# EAGLE schematic Cont (EAGLE 7.2.0)
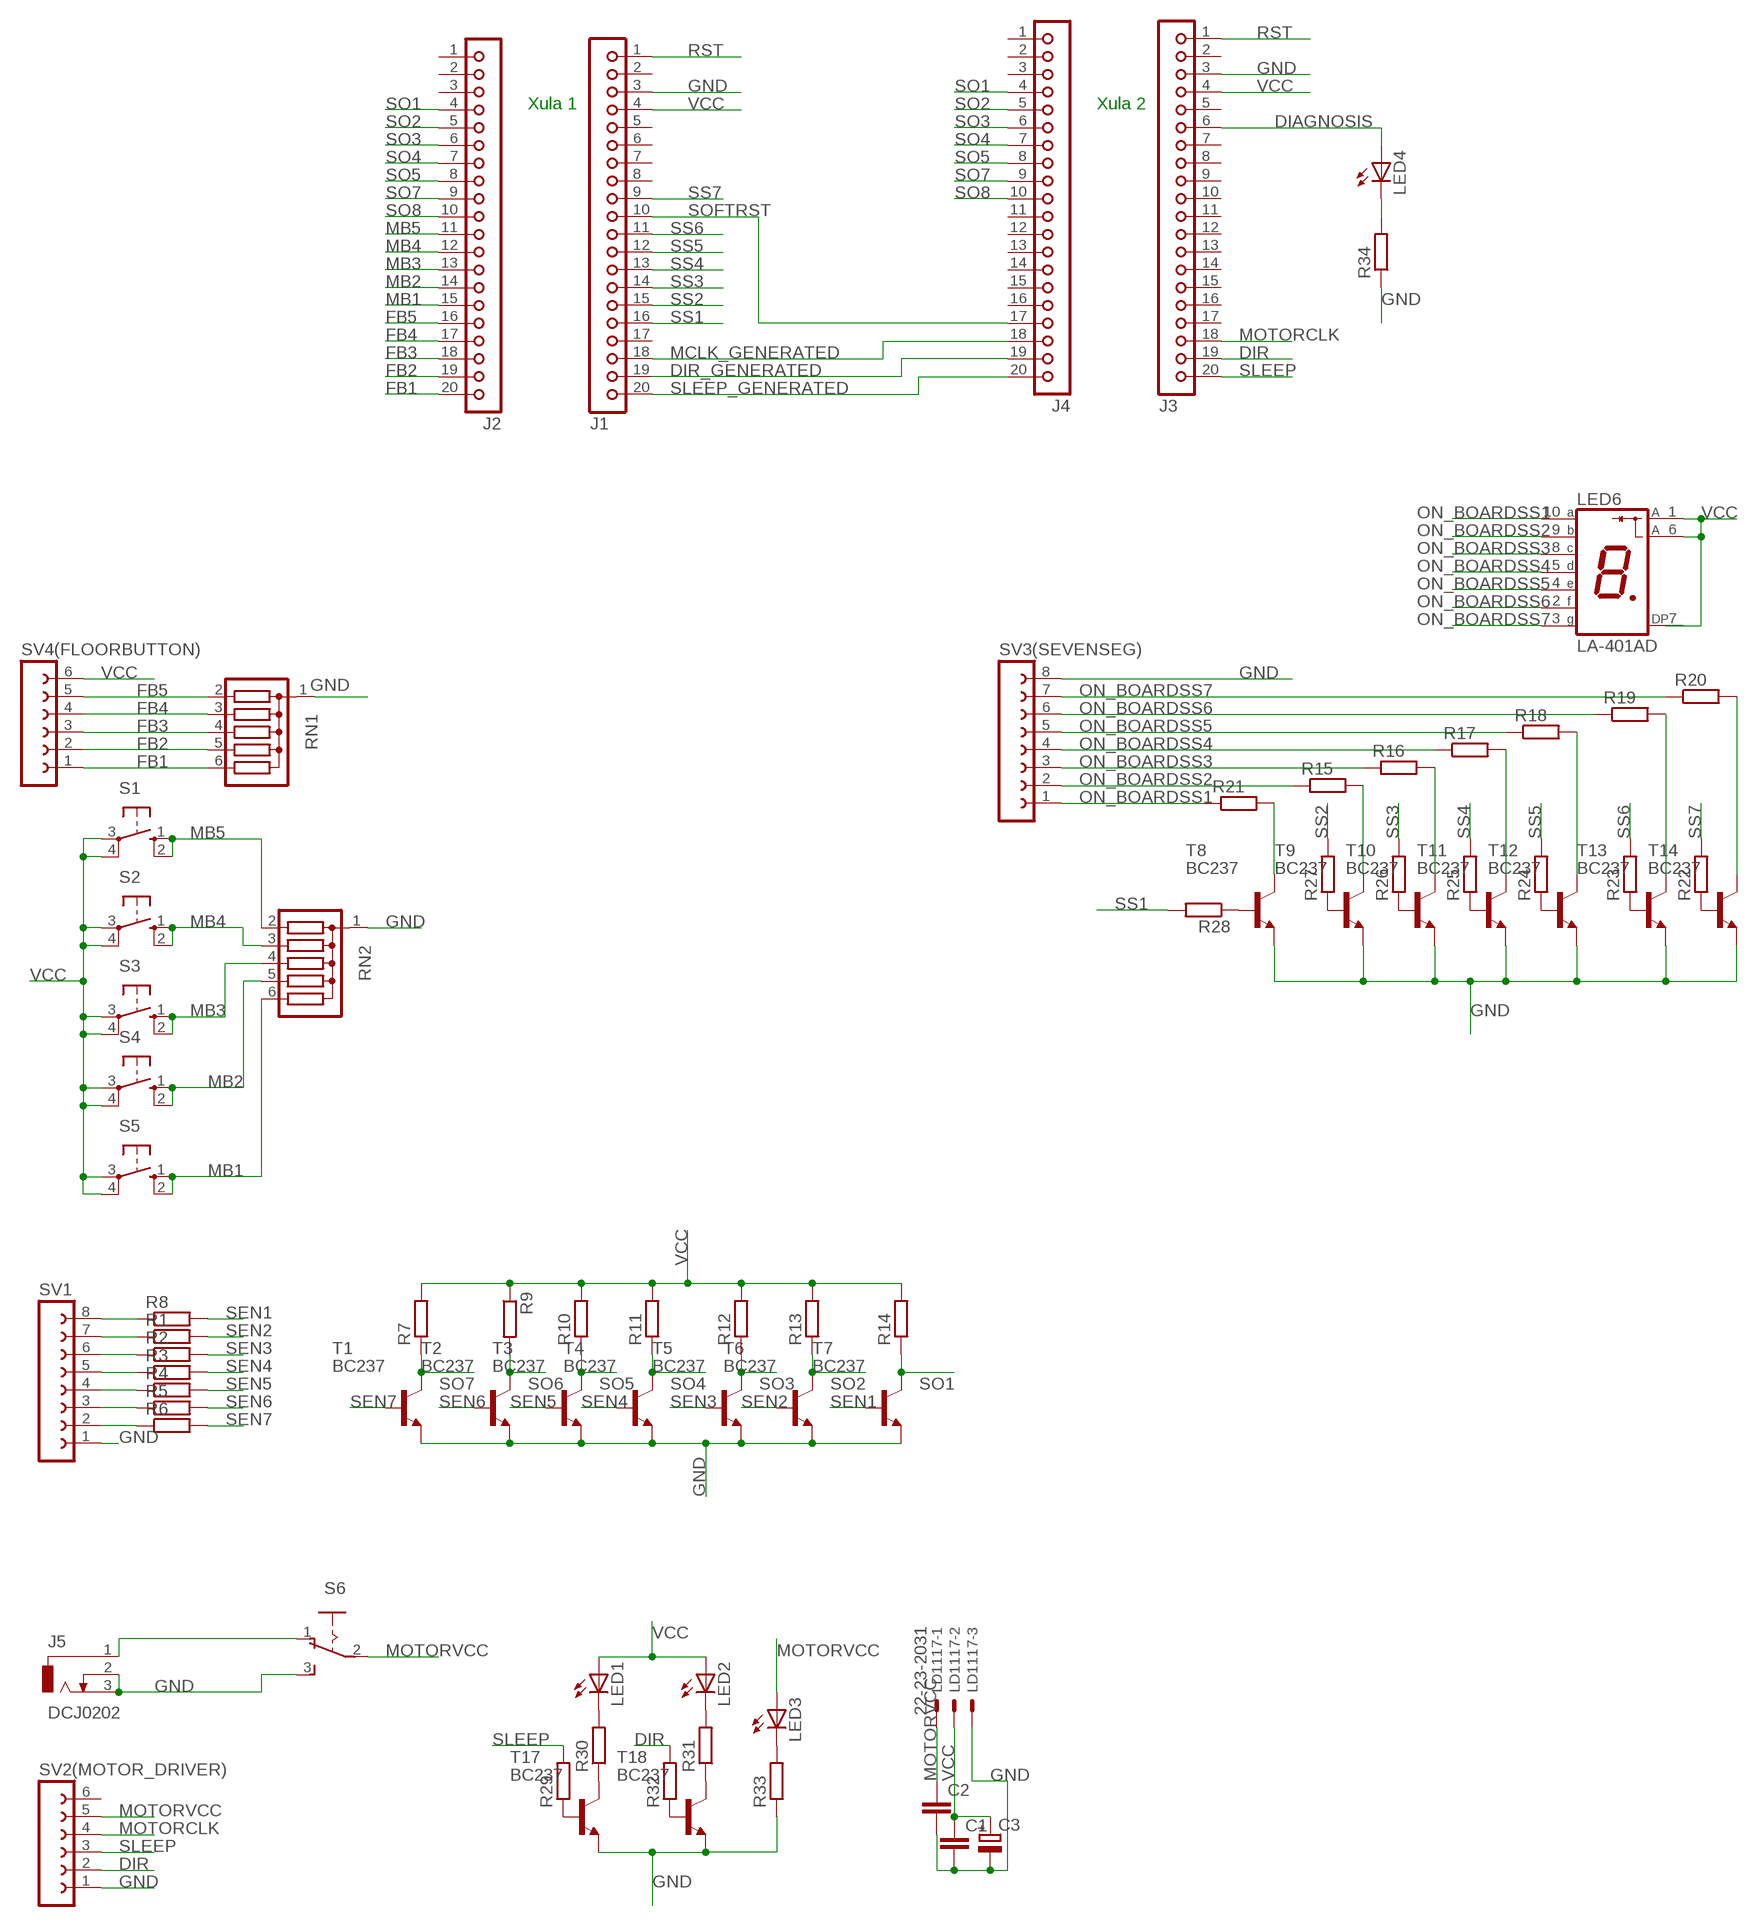
[diagram p0: schematic, sheet 1]

## Parts
C1  C-EU025-025X050  [C025-025X050]
C2  C-EU025-025X050  [C025-025X050]
C3  CPOL-EUE3.5-8  [E3,5-8]
J1  JBK20  [JBK20]
J2  JBK20  [JBK20]
J3  JBK20  [JBK20]
J4  JBK20  [JBK20]
J5  DCJ0202  [DCJ0202]
LD1117  22-23-2031  [22-23-2031]
LED1  LED3MM  [LED3MM]
LED2  LED3MM  [LED3MM]
LED3  LED3MM  [LED3MM]
LED4  LED3MM  [LED3MM]
LED6  LA-401AD  [LA-401]
R1  R-EU_0204/5  [0204/5]
R2  R-EU_0204/5  [0204/5]
R3  R-EU_0204/5  [0204/5]
R4  R-EU_0204/5  [0204/5]
R5  R-EU_0204/5  [0204/5]
R6  R-EU_0204/5  [0204/5]
R7  R-EU_0204/5  [0204/5]
R8  R-EU_0204/5  [0204/5]
R9  R-EU_0204/5  [0204/5]
R10  R-EU_0204/5  [0204/5]
R11  R-EU_0204/5  [0204/5]
R12  R-EU_0204/5  [0204/5]
R13  R-EU_0204/5  [0204/5]
R14  R-EU_0204/5  [0204/5]
R15  R-EU_0204/5  [0204/5]
R16  R-EU_0204/5  [0204/5]
R17  R-EU_0204/5  [0204/5]
R18  R-EU_0204/5  [0204/5]
R19  R-EU_0204/5  [0204/5]
R20  R-EU_0204/5  [0204/5]
R21  R-EU_0204/5  [0204/5]
R22  R-EU_0204/5  [0204/5]
R23  R-EU_0204/5  [0204/5]
R24  R-EU_0204/5  [0204/5]
R25  R-EU_0204/5  [0204/5]
R26  R-EU_0204/5  [0204/5]
R27  R-EU_0204/5  [0204/5]
R28  R-EU_0204/5  [0204/5]
R29  R-EU_0204/5  [0204/5]
R30  R-EU_0204/5  [0204/5]
R31  R-EU_0204/5  [0204/5]
R32  R-EU_0204/5  [0204/5]
R33  R-EU_0204/5  [0204/5]
R34  R-EU_0204/5  [0204/5]
RN1  G05R  [SIL6]
RN2  G05R  [SIL6]
S1  10-XX  [B3F-10XX]
S2  10-XX  [B3F-10XX]
S3  10-XX  [B3F-10XX]
S4  10-XX  [B3F-10XX]
S5  10-XX  [B3F-10XX]
S6  255SB  [255SB]
SV1  FE08-1  [FE08]
SV2(MOTOR_DRIVER)  FE06-1  [FE06]
SV3(SEVENSEG)  FE08W  [FE08W]
SV4(FLOORBUTTON)  FE06-1  [FE06]
T1  BC237  [TO92]
T2  BC237  [TO92]
T3  BC237  [TO92]
T4  BC237  [TO92]
T5  BC237  [TO92]
T6  BC237  [TO92]
T7  BC237  [TO92]
T8  BC237  [TO92]
T9  BC237  [TO92]
T10  BC237  [TO92]
T11  BC237  [TO92]
T12  BC237  [TO92]
T13  BC237  [TO92]
T14  BC237  [TO92]
T17  BC237  [TO92]
T18  BC237  [TO92]

## Nets
DIAGNOSIS: J3.6 LED4.A
DIR: J3.19 R32.2 SV2(MOTOR_DRIVER).2
DIR_GENERATED: J1.19 J4.19
FB1: J2.20 RN1.6 SV4(FLOORBUTTON).1
FB2: J2.19 RN1.5 SV4(FLOORBUTTON).2
FB3: J2.18 RN1.4 SV4(FLOORBUTTON).3
FB4: J2.17 RN1.3 SV4(FLOORBUTTON).4
FB5: J2.16 RN1.2 SV4(FLOORBUTTON).5
GND: C1.2 C2.2 C3.- J1.3 J3.3 J5.2 J5.3 LD1117.3 R6.1 R33.1 R34.1 RN1.1 RN2.1 S6.3(S) SV1.1 SV1.2 SV2(MOTOR_DRIVER).1 SV3(SEVENSEG).8 T1.1(E) T2.1(E) T3.1(E) T4.1(E) T5.1(E) T6.1(E) T7.1(E) T8.1(E) T9.1(E) T10.1(E) T11.1(E) T12.1(E) T13.1(E) T14.1(E) T17.1(E) T18.1(E)
MB1: J2.15 RN2.6 S5.1(S) S5.2(S1)
MB2: J2.14 RN2.5 S4.1(S) S4.2(S1)
MB3: J2.13 RN2.4 S3.1(S) S3.2(S1)
MB4: J2.12 RN2.3 S2.1(S) S2.2(S1)
MB5: J2.11 RN2.2 S1.1(S) S1.2(S1)
MCLK_GENERATED: J1.18 J4.18
MOTORCLK: J3.18 SV2(MOTOR_DRIVER).4
MOTORVCC: C2.1 LD1117.1 LED3.A S6.2(P) SV2(MOTOR_DRIVER).5
N$1: R2.1 SV1.6
N$2: R21.2 T8.3(C)
N$3: LED4.K(C) R34.2
N$4: R15.2 T9.3(C)
N$5: R16.2 T10.3(C)
N$6: R17.2 T11.3(C)
N$7: R18.2 T12.3(C)
N$8: R19.2 T13.3(C)
N$9: R5.1 SV1.3
N$10: R4.1 SV1.4
N$11: R3.1 SV1.5
N$12: R1.1 SV1.7
N$13: R8.1 SV1.8
N$14: R20.2 T14.3(C)
N$15: J5.1 S6.1(O)
N$28: R22.1 T14.2(B)
N$29: R23.1 T13.2(B)
N$30: R24.1 T12.2(B)
N$31: R25.1 T11.2(B)
N$32: R26.1 T10.2(B)
N$33: R27.1 T9.2(B)
N$34: R28.1 T8.2(B)
N$35: R29.1 T17.2(B)
N$36: R30.1 T17.3(C)
N$37: R31.1 T18.3(C)
N$38: R32.1 T18.2(B)
N$39: LED3.K(C) R33.2
N$40: LED1.K(C) R30.2
N$41: LED2.K(C) R31.2
ON_BOARDSS1: LED6.10(A) R21.1 SV3(SEVENSEG).1
ON_BOARDSS2: LED6.9(B) R15.1 SV3(SEVENSEG).2
ON_BOARDSS3: LED6.8(C) R16.1 SV3(SEVENSEG).3
ON_BOARDSS4: LED6.5(D) R17.1 SV3(SEVENSEG).4
ON_BOARDSS5: LED6.4(E) R18.1 SV3(SEVENSEG).5
ON_BOARDSS6: LED6.2(F) R19.1 SV3(SEVENSEG).6
ON_BOARDSS7: LED6.3(G) R20.1 SV3(SEVENSEG).7
RST: J1.1 J3.1
SEN1: R8.2 T7.2(B)
SEN2: R1.2 T6.2(B)
SEN3: R2.2 T5.2(B)
SEN4: R3.2 T4.2(B)
SEN5: R4.2 T3.2(B)
SEN6: R5.2 T2.2(B)
SEN7: R6.2 T1.2(B)
SLEEP: J3.20 R29.2 SV2(MOTOR_DRIVER).3
SLEEP_GENERATED: J1.20 J4.20
SO1: J2.4 J4.4 R14.1 T7.3(C)
SO2: J2.5 J4.5 R13.1 T6.3(C)
SO3: J2.6 J4.6 R12.1 T5.3(C)
SO4: J2.7 J4.7 R11.1 T4.3(C)
SO5: J2.8 J4.8 R10.1 T3.3(C)
SO6: R9.2 T2.3(C)
SO7: J2.9 J4.9 R7.1 T1.3(C)
SO8: J2.10 J4.10
SOFTRST: J1.10 J4.17
SS1: J1.16 R28.2
SS2: J1.15 R27.2
SS3: J1.14 R26.2
SS4: J1.13 R25.2
SS5: J1.12 R24.2
SS6: J1.11 R23.2
SS7: J1.9 R22.2
VCC: C1.1 C3.+ J1.4 J3.4 LD1117.2 LED1.A LED2.A LED6.1(A) LED6.6(A) R7.2 R9.1 R10.2 R11.2 R12.2 R13.2 R14.2 S1.3(P) S1.4(P1) S2.3(P) S2.4(P1) S3.3(P) S3.4(P1) S4.3(P) S4.4(P1) S5.3(P) S5.4(P1) SV4(FLOORBUTTON).6
Unconnected: J1.2 J1.5 J1.6 J1.7 J1.8 J1.17 J2.1 J2.2 J2.3 J3.2 J3.5 J3.7 J3.8 J3.9 J3.10 J3.11 J3.12 J3.13 J3.14 J3.15 J3.16 J3.17 J4.1 J4.2 J4.3 J4.11 J4.12 J4.13 J4.14 J4.15 J4.16 LED6.7(DP) SV2(MOTOR_DRIVER).6

## Notes on the sheet
- Xula 1 | Xula 2

## Library data of the parts
C1 C2 = rcl:C-EU: CAPACITOR, European symbol
C3 = rcl:CPOL-EU: POLARIZED CAPACITOR, European symbol
J1-J4 = con-lsta:JBK20: PIN HEADER; OC_FARNELL: unknown; OC_NEWARK: unknown
J5 = con-jack:DCJ0202: DC POWER JACK Source: DCJ0202.pdf; OC_FARNELL: unknown; OC_NEWARK: unknown
LD1117 = con-molex:22-23-2031: .100" (2.54mm) Center Header - 3 Pin; MF: MOLEX; MPN: 22-23-2031; OC_FARNELL: 1462950; OC_NEWARK: 30C0862
LED1-LED4 = led:LED: LED OSRAM: - CHIPLED LG R971, LG N971, LY N971, LG Q971, LY Q971, LO R971, LY R971 LH N974, LH R974 LS Q976, LO Q976, LY Q976 LO Q996 - Hyper CHIPLED LW Q18S LB Q993, LB Q99A, LB R99A - SideLED LS A670, LO A670, LY A670, LG A670, LP A670 LB A673, LV A673, LT A673, LW A673 LH A674 LY A675 LS A676, LA A676, LO A676, LY A676, LW A676 LS A679, LY A679, LG A679 - Hyper Micro SIDELED® LS Y876, LA Y876, LO Y876, LY Y876 LT Y87S - SmartLED LW L88C, LW L88S LB L89C, LB L89S, LG L890 LS L89K, LO L89K, LY L89K LS L896, LA L896, LO L896, LY L896 - TOPLED LS T670, LO T670, LY T670, LG T670, LP T670 LSG T670, LSP T670, LSY T670, LOP T670, LYG T670 LG T671, LOG T671, LSG T671 LB T673, LV T673, LT T673, LW T673 LH T674 LS T676, LA T676, LO T676, LY T676, LB T676, LH T676, LSB T676, LW T676 LB T67C, LV T67C, LT T67C, LS T67K, LO T67K, LY T67K, LW E67C LS E67B, LA E67B, LO E67B, LY E67B, LB E67C, LV E67C, LT E67C LW T67C LS T679, LY T679, LG T679 LS T770, LO T770, LY T770, LG T770, LP T770 LB T773, LV T773, LT T773, LW T773 LH T774 LS E675, LA E675, LY E675, LS T675 LS T776, LA T776, LO T776, LY T776, LB T776 LHGB T686 LT T68C, LB T68C - Hyper Mini TOPLED® LB M676 - Mini TOPLED Santana® LG M470 LS M47K, LO M47K, LY M47K Source: http://www.osram.convergy.de LUXEON: - LUMILED® LXK2-PW12-R00, LXK2-PW12-S00, LXK2-PW14-U00, LXK2-PW14-V00 LXK2-PM12-R00, LXK2-PM12-S00, LXK2-PM14-U00 LXK2-PE12-Q00, LXK2-PE12-R00, LXK2-PE12-S00, LXK2-PE14-T00, LXK2-PE14-U00 LXK2-PB12-K00, LXK2-PB12-L00, LXK2-PB12-M00, LXK2-PB14-N00, LXK2-PB14-P00, LXK2-PB14-Q00 LXK2-PR12-L00, LXK2-PR12-M00, LXK2-PR14-Q00, LXK2-PR14-R00 LXK2-PD12-Q00, LXK2-PD12-R00, LXK2-PD12-S00 LXK2-PH12-R00, LXK2-PH12-S00 LXK2-PL12-P00, LXK2-PL12-Q00, LXK2-PL12-R00 Source: www.luxeon.com KINGBRIGHT: KA-3528ASYC Source: www.kingbright.com
LED6 = led-7-segment:LA-401*D: Single Digit LED Numeric Display (anode common) Source: ROHM .. la-1401dn.pdf; OC_FARNELL: unknown; OC_NEWARK: unknown
R1-R34 = rcl:R-EU_: RESISTOR, European symbol
RN1 RN2 = resistor-sil:G05R: SIL RESISTOR; OC_FARNELL: unknown; OC_NEWARK: unknown
S1-S5 = switch-omron:10-XX: OMRON SWITCH; MPN: B3F-1000; OC_FARNELL: 176432; OC_NEWARK: 36M3542
S6 = switch:255SB: SLIDING SWITCH Distributor Buerklin, 11G810
SV1 = con-lsta:FE08-1: FEMALE HEADER; OC_FARNELL: unknown; OC_NEWARK: unknown
SV2(MOTOR_DRIVER) SV4(FLOORBUTTON) = con-lsta:FE06-1: FEMALE HEADER; OC_FARNELL: unknown; OC_NEWARK: unknown
SV3(SEVENSEG) = con-lsta:FE08W: FEMALE HEADER; OC_FARNELL: unknown; OC_NEWARK: unknown
T1-T14 T17 T18 = transistor-neu-to92:BC237: NPN TRANSISTOR